# EAGLE design thermocontrol (EAGLE 9.6.2)
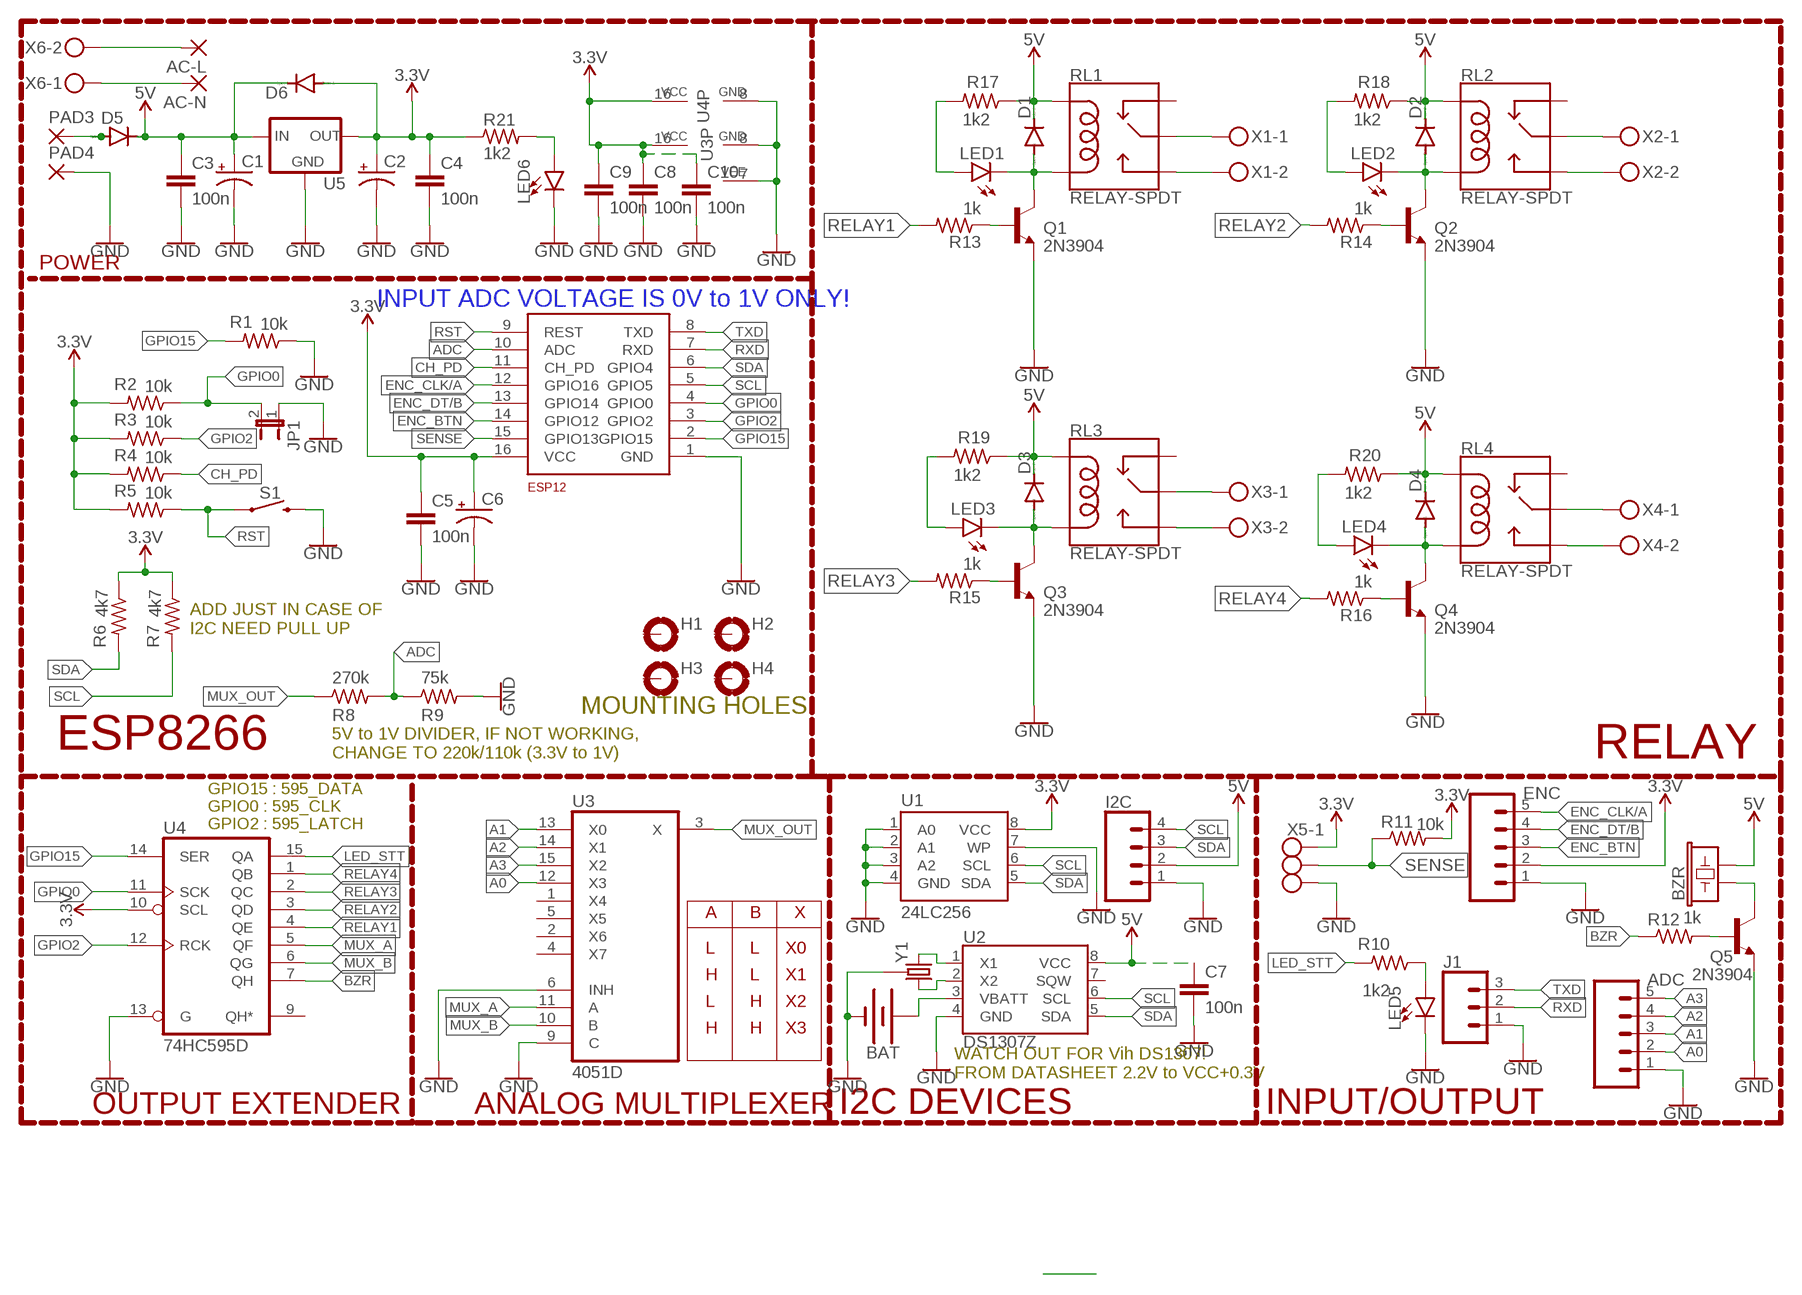
[diagram p0: schematic, sheet 1]

## Parts
AC-L  2,54/1,1  [2,54/1,1]
AC-N  2,54/1,1  [2,54/1,1]
ADC  CONN_05  [1X05]
BAT  BATTERY-20MM_PTH_KIT  [BATTCOM_20MM_PTH_KIT]
BZR  BUZZER-PTH_KIT  [BUZZER-12MM-KIT]
C1  CPOL-USE2.5-6  [E2,5-6]
C2  CPOL-USE2.5-6  [E2,5-6]
C3  100n  C-EUC0805  [C0805]
C4  100n  C-EUC0805  [C0805]
C5  100n  C-EUC0805  [C0805]
C6  CPOL-USD/7343-31R  [D/7343-31R]
C7  100n  C-EUC0805  [C0805]
C8  100n  C-EUC0805  [C0805]
C9  100n  C-EUC0805  [C0805]
C10  100n  C-EUC0805  [C0805]
D1  DIODE-DO-214AC  [DO-214AC]
D2  DIODE-DO-214AC  [DO-214AC]
D3  DIODE-DO-214AC  [DO-214AC]
D4  DIODE-DO-214AC  [DO-214AC]
D5  DIODE-DO-214AC  [DO-214AC]
D6  DIODE-DO-214AC  [DO-214AC]
ENC  CONN_05  [1X05]
ESP12  ESP8266_ESP-12  [ESP8266-ESP12]
H1  MOUNT-PAD-ROUND2.8  [2,8-PAD]
H2  MOUNT-PAD-ROUND2.8  [2,8-PAD]
H3  MOUNT-PAD-ROUND2.8  [2,8-PAD]
H4  MOUNT-PAD-ROUND2.8  [2,8-PAD]
I2C  CONN_04PTH  [1X04]
J1  455-1750-1-ND  CONN_03  [1X03]
JP1  JP1E  [JP1]
LED1  LEDCHIP-LED0805  [CHIP-LED0805]
LED2  LEDCHIP-LED0805  [CHIP-LED0805]
LED3  LEDCHIP-LED0805  [CHIP-LED0805]
LED4  LEDCHIP-LED0805  [CHIP-LED0805]
LED5  LEDCHIP-LED0805  [CHIP-LED0805]
LED6  LEDCHIP-LED0805  [CHIP-LED0805]
PAD3  2,54/1,1  [2,54/1,1]
PAD4  2,54/1,1  [2,54/1,1]
Q1  2N3904  [TO92]
Q2  2N3904  [TO92]
Q3  2N3904  [TO92]
Q4  2N3904  [TO92]
Q5  2N3904  [TO92]
R1  10k  R-US_M0805  [M0805]
R2  10k  R-US_M0805  [M0805]
R3  10k  R-US_M0805  [M0805]
R4  10k  R-US_M0805  [M0805]
R5  10k  R-US_M0805  [M0805]
R6  4k7  R-US_M0805  [M0805]
R7  4k7  R-US_M0805  [M0805]
R8  270k  R-US_M0805  [M0805]
R9  75k  R-US_M0805  [M0805]
R10  1k2  R-US_M0805  [M0805]
R11  10k  R-US_M0805  [M0805]
R12  1k  R-US_M0805  [M0805]
R13  1k  R-US_M0805  [M0805]
R14  1k  R-US_M0805  [M0805]
R15  1k  R-US_M0805  [M0805]
R16  1k  R-US_M0805  [M0805]
R17  1k2  R-US_M0805  [M0805]
R18  1k2  R-US_M0805  [M0805]
R19  1k2  R-US_M0805  [M0805]
R20  1k2  R-US_M0805  [M0805]
R21  1k2  R-US_M0805  [M0805]
RL1  RELAY-SPDT  [RELAY_G5LE]
RL2  RELAY-SPDT  [RELAY_G5LE]
RL3  RELAY-SPDT  [RELAY_G5LE]
RL4  RELAY-SPDT  [RELAY_G5LE]
S1  MOMENTARY-SWITCH-SPST-SMD-6.2MM-TALL  [TACTILE_SWITCH_SMD_6.2MM_TALL]
U1  24LC256  EEPROM-I2C256K  [SO08]
U2  DS1307Z  [SO08-0.15]
U3  4051D  [SO16]
U4  74HC595D  [SO16]
U5  XC63FPP  [SOT89R]
X1  MKDSN1,5/2-5,08  [MKDSN1,5/2-5,08]
X2  MKDSN1,5/2-5,08  [MKDSN1,5/2-5,08]
X3  MKDSN1,5/2-5,08  [MKDSN1,5/2-5,08]
X4  MKDSN1,5/2-5,08  [MKDSN1,5/2-5,08]
X5  MKDSN1,5/3-5,08  [MKDSN1,5/3-5,08]
X6  MKDSN1,5/2-5,08  [MKDSN1,5/2-5,08]
Y1  CRYSTAL-32.768KHZ-CT  [CRYSTAL-PTH-2X6-CYL]

## Nets
3.3V: C2.+ C4.1 C5.1 C6.+ C8.1 C9.1 C10.1 D6.A ENC.2 ESP12.16(VCC) R2.2 R3.2 R4.2 R5.2 R6.1 R7.1 R11.2 R21.1 U1.8(VCC) U3.16(VCC) U4.10(SCL) U4.16(VCC) U5.3(OUT) U5.4(OUT) X5.1
5V: BZR.- C1.+ C3.1 C7.1 D1.C D2.C D3.C D4.C D5.C D6.C I2C.2 R17.1 R18.1 R19.1 R20.1 RL1.2(COIL1) RL2.2(COIL1) RL3.2(COIL1) RL4.2(COIL1) U2.8(VCC) U5.2(IN)
A0: ADC.2 U3.12(X3)
A1: ADC.3 U3.13(X0)
A2: ADC.4 U3.14(X1)
A3: ADC.5 U3.15(X2)
ADC: ESP12.10(ADC) R8.2 R9.1
BZR: R12.1 U4.7(QH)
CH_PD: ESP12.11(CH_PD) R4.1
ENC_BTN: ENC.3 ESP12.14(GPIO12)
ENC_CLK/A: ENC.5 ESP12.12(GPIO16)
ENC_DT/B: ENC.4 ESP12.13(GPIO14)
GND: ADC.1 BAT.2(-) C1.- C2.- C3.2 C4.2 C5.2 C6.- C7.2 C8.2 C9.2 C10.2 ENC.1 ESP12.1(GND) I2C.1 J1.1 JP1.1 LED5.C LED6.C PAD4.1(P) Q1.3(E) Q2.3(E) Q3.3(E) Q4.3(E) Q5.3(E) R1.1 R9.2 S1.B2 U1.1(A0) U1.2(A1) U1.3(A2) U1.4(GND) U2.4(GND) U3.6(INH) U3.7(VEE) U3.8(GND) U3.9(C) U4.8(GND) U4.13(G) U5.1(GND) X5.3 Y1.P$1(GND)
GPIO0: ESP12.4(GPIO0) JP1.2 R2.1 U4.11(SCK)
GPIO2: ESP12.3(GPIO2) R3.1 U4.12(RCK)
GPIO15: ESP12.2(GPIO15) R1.2 U4.14(SER)
LED_STT: R10.2 U4.15(QA)
MUX_A: U3.11(A) U4.5(QF)
MUX_B: U3.10(B) U4.6(QG)
MUX_OUT: R8.1 U3.3(X)
N$1: Q4.2(B) R16.1
N$2: Q2.2(B) R14.1
N$3: Q1.2(B) R13.1
N$4: Q3.2(B) R15.1
N$5: Q5.2(B) R12.2
N$6: LED1.A R17.2
N$7: LED2.A R18.2
N$8: D5.A PAD3.1(P)
N$9: LED3.A R19.2
N$10: AC-N.1(P) X6.1
N$11: AC-L.1(P) X6.2
N$12: LED4.A R20.2
N$13: U1.7(WP) ; supply symbol labelled GND
N$17: D1.A LED1.C Q1.1(C) RL1.5(COIL2)
N$18: LED6.A R21.2
N$19: RL1.3(NO) X1.2
N$20: RL1.1(MAIN) X1.1
N$21: D2.A LED2.C Q2.1(C) RL2.5(COIL2)
N$22: RL2.3(NO) X2.2
N$23: RL2.1(MAIN) X2.1
N$24: D3.A LED3.C Q3.1(C) RL3.5(COIL2)
N$25: RL3.3(NO) X3.2
N$26: RL3.1(MAIN) X3.1
N$27: D4.A LED4.C Q4.1(C) RL4.5(COIL2)
N$28: RL4.3(NO) X4.2
N$29: RL4.1(MAIN) X4.1
N$30: BAT.1(+) U2.3(VBATT)
N$31: BZR.+ Q5.1(C)
N$33: LED5.A R10.1
N$34: U2.2(X2) Y1.2
N$35: U2.1(X1) Y1.1
RELAY1: R13.2 U4.4(QE)
RELAY2: R14.2 U4.3(QD)
RELAY3: R15.2 U4.2(QC)
RELAY4: R16.2 U4.1(QB)
RST: ESP12.9(REST) R5.1 S1.A2
RXD: ESP12.7(RXD) J1.2
SCL: ESP12.5(GPIO5) I2C.4 R7.2 U1.6(SCL) U2.6(SCL)
SDA: ESP12.6(GPIO4) I2C.3 R6.2 U1.5(SDA) U2.5(SDA)
SENSE: ESP12.15(GPIO13) R11.1 X5.2
TXD: ESP12.8(TXD) J1.3
Unconnected: H1.B2,8(MOUNT) H2.B2,8(MOUNT) H3.B2,8(MOUNT) H4.B2,8(MOUNT) RL1.4(NC) RL2.4(NC) RL3.4(NC) RL4.4(NC) U2.7(SQW) U3.1(X4) U3.2(X6) U3.4(X7) U3.5(X5) U4.9(QH*)

## Notes on the sheet
- POWER
- INPUT ADC VOLTAGE IS 0V to 1V ONLY!
- ADD JUST IN CASE OF 
  I2C NEED PULL UP
- MOUNTING HOLES
- ESP8266
- 5V to 1V DIVIDER, IF NOT WORKING, 
  CHANGE TO 220k/110k (3.3V to 1V)
- RELAY
- GPIO15 : 595_DATA
  GPIO0 : 595_CLK
  GPIO2 : 595_LATCH
- A | B | X
- L | L | X0
- H | L | X1
- L | H | X2
- H | H | X3
- WATCH OUT FOR Vih DS1307!
  FROM DATASHEET 2.2V to VCC+0.3V
- OUTPUT EXTENDER | ANALOG MULTIPLEXER | I2C DEVICES | INPUT/OUTPUT

## Library data of the parts
AC-L AC-N PAD3 PAD4 = wirepad:2,54/1,1: THROUGH-HOLE PAD
ADC ENC = SparkFun-Connectors:CONN_05: Multi connection point. Often used as Generic Header-pin footprint for 0.1 inch spaced/style header connections On any of the 0.1 inch spaced packages, you can populate with these: Break Away Headers - Straight <https://www.sparkfun.com/products/116> (PRT-00116) Break Away Male Headers - Right Angle <https://www.sparkfun.com/products/553> (PRT-00553) Female Headers <https://www.sparkfun.com/products/115> (PRT-00115) Break Away Headers - Machine Pin <https://www.sparkfun.com/products/117> (PRT-00117) Break Away Female Headers - Swiss Machine Pin <https://www.sparkfun.com/products/743> (PRT-00743) For SCREWTERMINALS and SPRING TERMINALS visit here: Screw Terimnals on SparkFun.com <https://www.sparkfun.com/search/results?term=Screw+Terminals> (5mm/3.5mm/2.54mm spacing) This device is also useful as a general connection point to wire up your design to another part of your project. Our various solder wires solder well into these plated through hole pads. Hook-Up Wire - Assortment (Stranded, 22 AWG) <https://www.sparkfun.com/products/11375> (PRT-11375) Hook-Up Wire - Assortment (Solid Core, 22 AWG) <https://www.sparkfun.com/products/11367> (PRT-11367) View the entire wire category on our website here <https://www.sparkfun.com/categories/141> Special notes: Molex polarized connector foot print use with SKU : PRT-08231 with associated crimp pins and housings. 1MM SMD Version SKU: PRT-10208
BAT = SparkFun-Batteries:BATTERY: Battery - Single Cell A variety of battery chemistries, sizes, and footprints. Device List: 20MM_PTH - Coin Cell Battery Holder - 20mm (PTH) <https://www.sparkfun.com/products/783> 20MM_PTH_KIT- Coin Cell battery Holder - 20 mm (PTH) <http://www.sparkfun.com/products/783>kit version with special mask 6.8MM_PTH - Coin Cell Battery Holder - 6.8MM(SMD) <https://www.digikey.com/product-detail/en/seiko-instruments/MS621FE-FL11E/728-1057-ND/1889208?WT.srch=1&gclid=CNOQ5a6LzdQCFZS2wAodXCkE0g> 12MM_SMD - Coin Cell Battery Holder - 12mm (SMD) <https://www.sparkfun.com/products/10592> 12MM_PTH - Coin Cell Battery Holder - 12mm (PTH) <https://www.sparkfun.com/products/7948> 20MM_SMD - 20mm Coin Cell Battery Holder (SMD) (2 legs) Used on the Big Time Watch Kit <https://www.sparkfun.com/products/11734> 20MM_SMD_4LEGS - Coin Cell Battery Holder - 20mm (SMD) <https://www.sparkfun.com/products/11892> 20MM_SMD_4LEGS_OVERPASTE - Coin Cell Battery Holder - 20mm (SMD) <https://www.sparkfun.com/products/11892> (Over-paste on the legs) 24.5MM_PTH - Coin Cell Battery Holder - 24.5mm (PTH) <https://www.sparkfun.com/products/8863> 9V - 9V Battery Holder - PC Mount Used on the SparkFun SparkPunk Sound Kit <https://www.sparkfun.com/products/11177> and SparkFun SparkPunk Sequencer Kit <https://www.sparkfun.com/products/12707> 18650 - Battery Holder - 18650 (PTH) <https://www.sparkfun.com/products/13113> AA - Battery Holder - 1xAA (PTH) <https://www.sparkfun.com/products/7949> AAA - Battery Holder - 1xAAA (PTH) <https://www.sparkfun.com/products/12718> AA_KIT - Battery Holder - 1xAA (PTH) <https://www.sparkfun.com/products/7949> Special kit package - pads only have exposed copper on one side of the board. AAA_KIT - Battery Holder - 1xAAA (PTH) <https://www.sparkfun.com/products/12718> Special kit package - pads only have exposed copper on one side of the board.
BZR = SparkFun-Electromechanical:BUZZER: Buzzer Small round buzzers that operate around the audible 2kHz range. You can use these as speakers to create simple music or user interfaces. Variant Overview: PTH - Mini Speaker - PC Mount 12mm 2.048kHz <https://www.sparkfun.com/products/7950> PTH_KIT - Mini Speaker - PC Mount 12mm 2.048kHz <https://www.sparkfun.com/products/7950> KIT simplifies soldering by adding stop mask to one side of the pads. PTH_NO_SILK - Mini Speaker - PC Mount 12mm 2.048kHz <https://www.sparkfun.com/products/7950> No silkscreen indicator of buzzer outline. PTH_KIT_NO_SILK - Mini Speaker - PC Mount 12mm 2.048kHz <https://www.sparkfun.com/products/7950> KIT package w/o silkscreen SMD - Buzzer Audio Magnetic (CCV-084B16) SMD buzzer used on, e.g. the LilyPad Buzzer <https://www.sparkfun.com/products/8463> and RFID USB Reader <https://www.sparkfun.com/products/9963>. SMD_KIT - Buzzer Audio Magnetic (CCV-084B16) SMD Buzzer with elongated pins to make soldering easier. Used on the SparkFun Simon Says - Surface Mount Soldering Kit <https://www.sparkfun.com/products/10935>.; PROD_ID: COMP-08253; SF_SKU: COM-07950
C1 C2 C6 = rcl:CPOL-US: POLARIZED CAPACITOR, American symbol; SPICEPREFIX: C
C3-C5 C7-C10 = rcl:C-EU: CAPACITOR, European symbol; SPICEPREFIX: C
D1-D6 = diode:DIODE-: DIODE
ESP12 = esp12:ESP8266_ESP-12
H1-H4 = holes:MOUNT-PAD-ROUND: MOUNTING PAD, round
I2C = SparkFun-Connectors:CONN_04: Multi connection point. Often used as Generic Header-pin footprint for 0.1 inch spaced/style header connections On any of the 0.1 inch spaced packages, you can populate with these: Break Away Headers - Straight <https://www.sparkfun.com/products/116> (PRT-00116) Break Away Male Headers - Right Angle <https://www.sparkfun.com/products/553> (PRT-00553) Female Headers <https://www.sparkfun.com/products/115> (PRT-00115) Break Away Headers - Machine Pin <https://www.sparkfun.com/products/117> (PRT-00117) Break Away Female Headers - Swiss Machine Pin <https://www.sparkfun.com/products/743> (PRT-00743) For SCREWTERMINALS and SPRING TERMINALS visit here: Screw Terimnals on SparkFun.com <https://www.sparkfun.com/search/results?term=Screw+Terminals> (5mm/3.5mm/2.54mm spacing) This device is also useful as a general connection point to wire up your design to another part of your project. Our various solder wires solder well into these plated through hole pads. Hook-Up Wire - Assortment (Stranded, 22 AWG) <https://www.sparkfun.com/products/11375> (PRT-11375) Hook-Up Wire - Assortment (Solid Core, 22 AWG) <https://www.sparkfun.com/products/11367> (PRT-11367) View the entire wire category on our website here <https://www.sparkfun.com/categories/141> Special notes: Molex polarized connector foot print use with SKU : PRT-08231 with associated crimp pins and housings. 1MM SMD Version SKU: PRT-10208; PROD_ID: CONN-09696
J1 = SparkFun-Connectors:CONN_03: Multi connection point. Often used as Generic Header-pin footprint for 0.1 inch spaced/style header connections On any of the 0.1 inch spaced packages, you can populate with these: Break Away Headers - Straight <https://www.sparkfun.com/products/116> (PRT-00116) Break Away Male Headers - Right Angle <https://www.sparkfun.com/products/553> (PRT-00553) Female Headers <https://www.sparkfun.com/products/115> (PRT-00115) Break Away Headers - Machine Pin <https://www.sparkfun.com/products/117> (PRT-00117) Break Away Female Headers - Swiss Machine Pin <https://www.sparkfun.com/products/743> (PRT-00743) Stackable Header - 3 Pin (Female, 0.1") <https://www.sparkfun.com/products/13875> (PRT-13875) For SCREWTERMINALS and SPRING TERMINALS visit here: Screw Terimnals on SparkFun.com <https://www.sparkfun.com/search/results?term=Screw+Terminals> (5mm/3.5mm/2.54mm spacing) This device is also useful as a general connection point to wire up your design to another part of your project. Our various solder wires solder well into these plated through hole pads. Hook-Up Wire - Assortment (Stranded, 22 AWG) <https://www.sparkfun.com/products/11375> (PRT-11375) Hook-Up Wire - Assortment (Solid Core, 22 AWG) <https://www.sparkfun.com/products/11367> (PRT-11367) View the entire wire category on our website here <https://www.sparkfun.com/categories/141> Special notes: Molex polarized connector foot print use with SKU : PRT-08232 with associated crimp pins and housings.; PROD_ID: XXX-00000
JP1 = jumper:JP1E: JUMPER
LED1-LED6 = led:LED: LED OSRAM: - CHIPLED LG R971, LG N971, LY N971, LG Q971, LY Q971, LO R971, LY R971 LH N974, LH R974 LS Q976, LO Q976, LY Q976 LO Q996 - Hyper CHIPLED LW Q18S LB Q993, LB Q99A, LB R99A - SideLED LS A670, LO A670, LY A670, LG A670, LP A670 LB A673, LV A673, LT A673, LW A673 LH A674 LY A675 LS A676, LA A676, LO A676, LY A676, LW A676 LS A679, LY A679, LG A679 - Hyper Micro SIDELED® LS Y876, LA Y876, LO Y876, LY Y876 LT Y87S - SmartLED LW L88C, LW L88S LB L89C, LB L89S, LG L890 LS L89K, LO L89K, LY L89K LS L896, LA L896, LO L896, LY L896 - TOPLED LS T670, LO T670, LY T670, LG T670, LP T670 LSG T670, LSP T670, LSY T670, LOP T670, LYG T670 LG T671, LOG T671, LSG T671 LB T673, LV T673, LT T673, LW T673 LH T674 LS T676, LA T676, LO T676, LY T676, LB T676, LH T676, LSB T676, LW T676 LB T67C, LV T67C, LT T67C, LS T67K, LO T67K, LY T67K, LW E67C LS E67B, LA E67B, LO E67B, LY E67B, LB E67C, LV E67C, LT E67C LW T67C LS T679, LY T679, LG T679 LS T770, LO T770, LY T770, LG T770, LP T770 LB T773, LV T773, LT T773, LW T773 LH T774 LS E675, LA E675, LY E675, LS T675 LS T776, LA T776, LO T776, LY T776, LB T776 LHGB T686 LT T68C, LB T68C - Hyper Mini TOPLED® LB M676 - Mini TOPLED Santana® LG M470 LS M47K, LO M47K, LY M47K Source: http://www.osram.convergy.de LUXEON: - LUMILED® LXK2-PW12-R00, LXK2-PW12-S00, LXK2-PW14-U00, LXK2-PW14-V00 LXK2-PM12-R00, LXK2-PM12-S00, LXK2-PM14-U00 LXK2-PE12-Q00, LXK2-PE12-R00, LXK2-PE12-S00, LXK2-PE14-T00, LXK2-PE14-U00 LXK2-PB12-K00, LXK2-PB12-L00, LXK2-PB12-M00, LXK2-PB14-N00, LXK2-PB14-P00, LXK2-PB14-Q00 LXK2-PR12-L00, LXK2-PR12-M00, LXK2-PR14-Q00, LXK2-PR14-R00 LXK2-PD12-Q00, LXK2-PD12-R00, LXK2-PD12-S00 LXK2-PH12-R00, LXK2-PH12-S00 LXK2-PL12-P00, LXK2-PL12-Q00, LXK2-PL12-R00 Source: www.luxeon.com KINGBRIGHT: KA-3528ASYC Source: www.kingbright.com
Q1-Q5 = transistor-npn:2N3904: NPN Transistor
R1-R21 = rcl:R-US_: RESISTOR, American symbol; SPICEPREFIX: R
RL1-RL4 = SparkFun-Electromechanical:RELAY-SPDT: SPDT Electromechanical Relay Single-pole, double-throw sealed relays. When current is applied to the coil, it throws a simple changeover switch, terminating the connection from the NC contact to ground and closing the NO contact. Use them to switch high voltage/high current devices. SparkFun Products JQX-15F: Relay SPDT Sealed - 20A <https://www.sparkfun.com/products/10924> (COM-10924) JZC-11F: Relay SPDT Sealed <https://www.sparkfun.com/products/100> (COM-00100); PROD_ID: COMP-14214
S1 = SparkFun-Switches:MOMENTARY-SWITCH-SPST: Momentary Switch (Pushbutton) - SPST Normally-open (NO) SPST momentary switches (buttons, pushbuttons). Variants PTH-12MM - 12mm square, through-hole Momentary Pushbutton Switch - 12mm Square <https://www.sparkfun.com/products/9190> (COM-09190) PTH-6.0MM, PTH-6.0MM-KIT - 6.0mm square, through-hole Mini Pushbutton Switch <https://www.sparkfun.com/products/97> (COM-00097) KIT package intended for soldering kit's - only one side of pads' copper is exposed. PTH-RIGHT-ANGLE-KIT - Right-angle, through-hole Right Angle Tactile Button <https://www.sparkfun.com/products/10791> - Used on SparkFun BigTime Watch Kit <https://www.sparkfun.com/products/11734> SMD-12MM - 12mm square, surface-mount Tactile Button - SMD (12mm) <https://www.sparkfun.com/products/12993> (COM-12993) Used on SparkFun PicoBoard <https://www.sparkfun.com/products/11888> SMD-4.5MM - 4.5mm Square Trackball Switch Used on SparkFun Blackberry Trackballer Breakout <https://www.sparkfun.com/products/13169> SMD-4.6MMX2.8MM - 4.60mm x 2.80mm, surface mount Used on SparkFun SAMD21 Mini Breakout <https://www.sparkfun.com/products/13664> SMD-5.2MM, SMD-5.2-REDUNDANT - 5.2mm square, surface-mount Mini Pushbutton Switch - SMD <https://www.sparkfun.com/products/8720> (COM-08720) Used on Arduino Pro Mini <https://www.sparkfun.com/products/11114> REDUNDANT package connects both switch circuits together SMD-6.0X3.5MM - 6.0 x 3.5mm, surface mount Momentary Reset Switch SMD <https://www.sparkfun.com/products/8229> (COM-08229) SMD-6.2MM-TALL - 6.2mm square, surface mount Tactile Button - SMD (6mm) <https://www.sparkfun.com/products/12992> Used on SparkFun Digital Sandbox <https://www.sparkfun.com/products/12651> SMD-RIGHT-ANGLE - Right-angle, surface mount Used on SparkFun Block for Intel® Edison - Arduino <https://www.sparkfun.com/products/13036>; PROD_ID: SWCH-11966; SF_SKU: COM-12992
U1 = SparkFun-IC-Memory:EEPROM-I2C: I2C EEPROMs, 24LC256 and others 24LC256 Series 256 kb I2C 2 Wire (32 k x 8 Bit) 2.5 V Serial EEPROM SMD - SOIC-8 Datasheet SparkFun Products SparkFun UDB5 - PIC UAV Development Board <https://www.sparkfun.com/products/11703> (GPS-11703); PROD_ID: IC-09714
U2 = SparkFun-Clocks:DS1307: Maxim DS1307 - I2C Real-time clock (RTC) The DS1307 serial real-time clock (RTC) is a low-power, full binary-coded decimal (BCD) clock/calendar plus 56 bytes of NV SRAM. Address and data are transferred serially through an I2C, bidirectional bus. The clock/calendar provides seconds, minutes, hours, day, date, month, and year information. SparkFun Products: Real Time Clock Module <https://www.sparkfun.com/products/12708> (BOB-12708) Datasheet <https://cdn.sparkfun.com/datasheets/BreakoutBoards/DS1307.pdf>; PROD_ID: IC-08138
U3 = 40xx:4051: 8-channel ANALOG MULTIPLEXER
U4 = 74xx-eu:74*595: 8-bit SHIFT REGISTER, output latch
U5 = v-reg:XC63FP: Positiv Voltage Regulators www.torex.co.jp/english/product/pro02/pdf/0201_xc62fp.pdf
X1-X4 X6 = con-phoenix-508:MKDSN1,5/2-5,08: MKDSN 1,5/ 2-5,08 Printklemme Nennstrom: 13,5 A Nennspannung: 250 V Rastermaß: 5,08 mm Polzahl: 2 Anschlussart: Schraubanschluss Montage: Löten Anschlussrichtung Leiter/Platine: 0 ° Artikelnummer: 1729128 Source: http://eshop.phoenixcontact.com .. 1729128.pdf
X5 = con-phoenix-508:MKDSN1,5/3-5,08: MKDSN 1,5/ 3-5,08 Printklemme Nennstrom: 13,5 A Nennspannung: 250 V Rastermaß: 5,08 mm Polzahl: 3 Anschlussart: Schraubanschluss Montage: Löten Anschlussrichtung Leiter/Platine: 0 ° Artikelnummer: 1729131 Source: http://eshop.phoenixcontact.com .. 1729131.pdf
Y1 = SparkFun-Clocks:CRYSTAL-32.768KHZ-CT

## Board
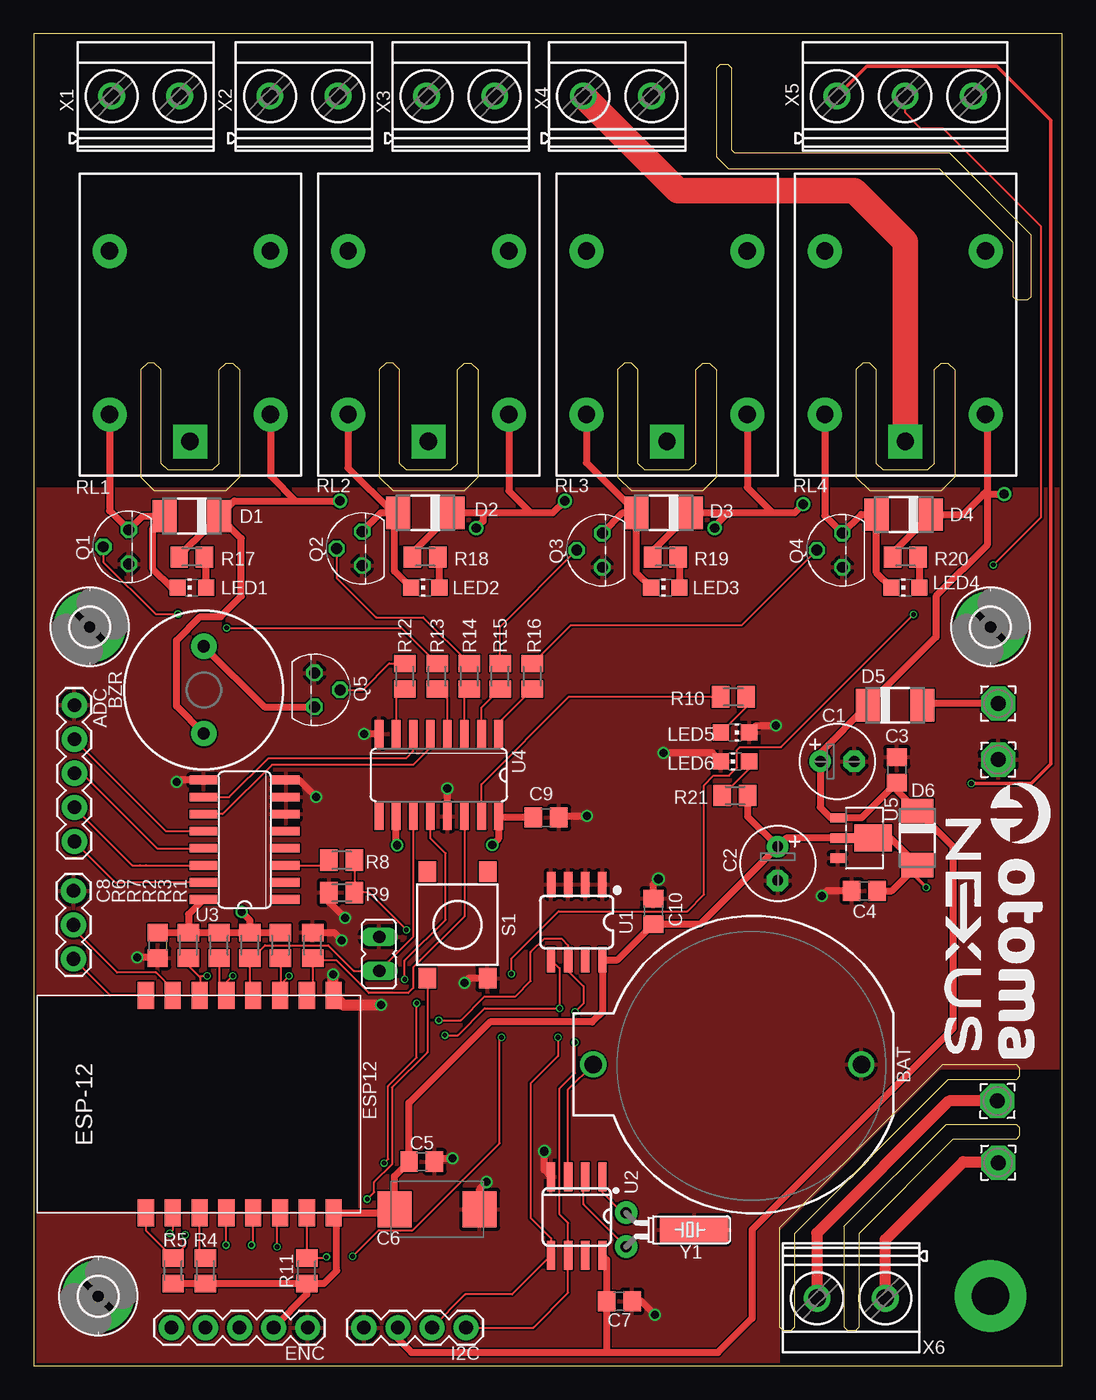
[diagram p1: board, top side]
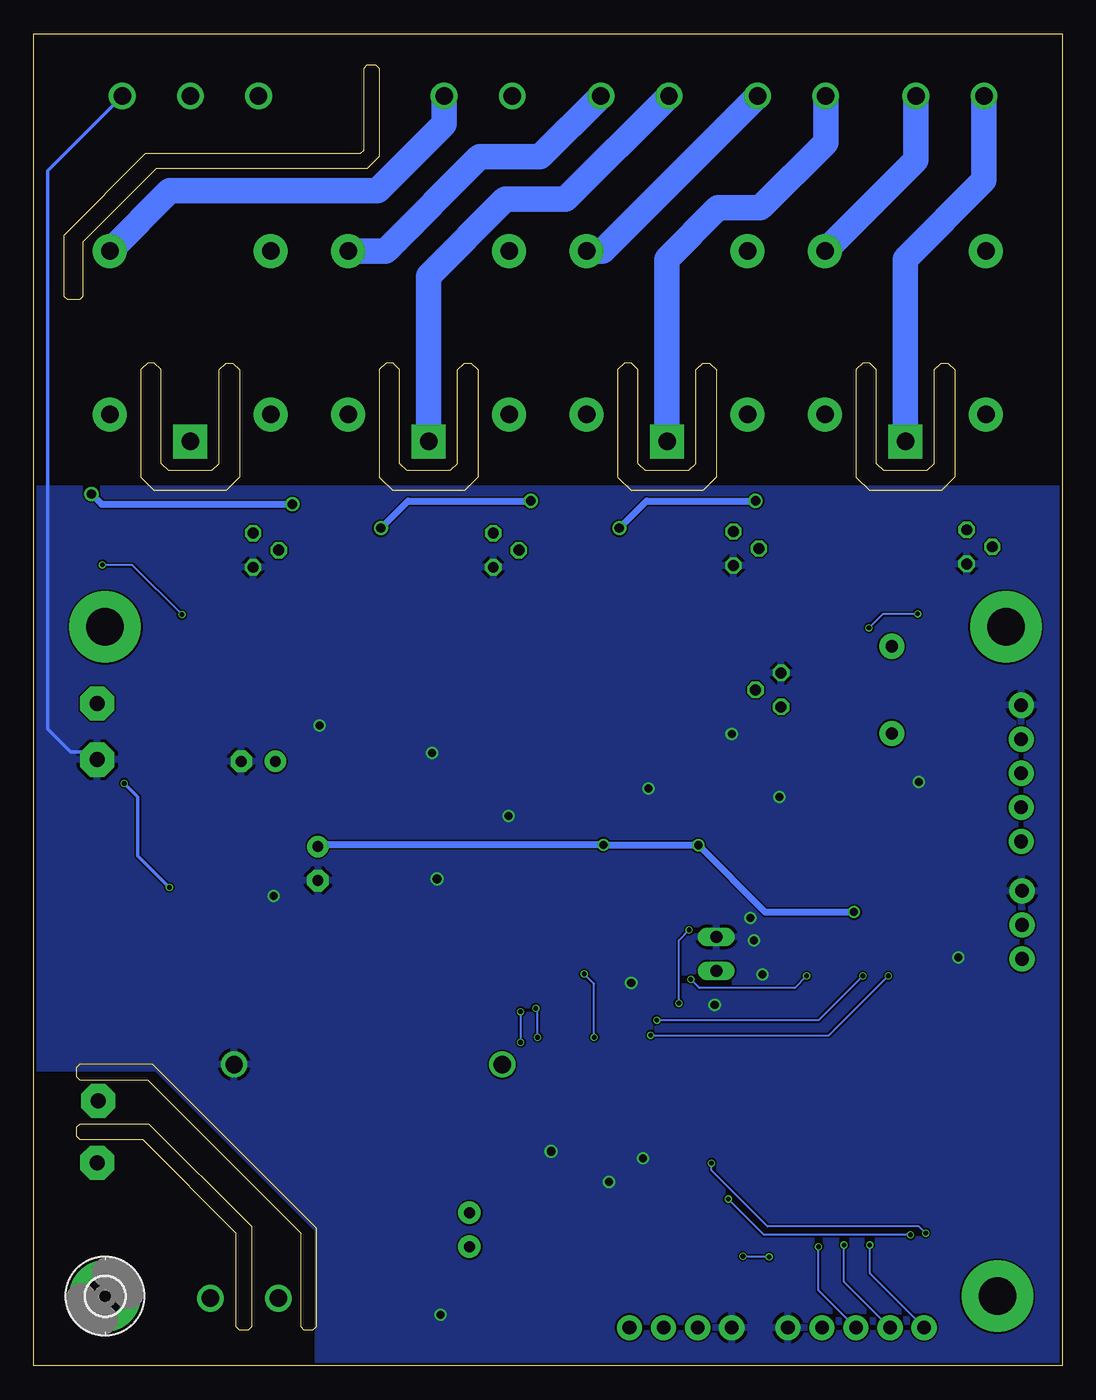
[diagram p2: board, bottom side, seen from below]

Size 76.71 x 99.36 mm. Coordinates in mm from the lower left corner, seen from the top.
Outline: 0,0 76.71,0 76.71,99.36 0,99.36 0,0
Copper layers (1*16): Top 0.035559375mm / dielectric 1.6mm / Bottom 0.035559375mm
Design rules "jlcpcb2layer *": minimum track width 5mil, minimum drill 12mil, track to track 5mil, track to pad 5mil, pad to pad 5mil, via to via 5mil, smd to smd 5mil, copper to edge 8mil, drill to drill 6mil, minimum pad ring 5mil, minimum via ring 3mil, stop-mask expansion 2.5mil, vias tented up to drill 33mil, thermal gap 10mil
Milling: 104 lines

### Footprints (pad centres in the part's own frame; a part is rotated, then mirrored left to right if it is on the bottom)
2,54/1,1 = drill 1.118 pad 2.54 octagon: 1 0,0
1X05 = drill 1.016 pad 1.88: 1 0,0; 2 2.54,0; 3 5.08,0; 4 7.62,0; 5 10.16,0
BATTCOM_20MM_PTH_KIT = drill 1.3: 1 11.85,0; 2 -8.15,0
BUZZER-12MM-KIT = drill 0.9 pad 1.88: + 3.25,0; - -3.25,0
E2,5-6 = drill 0.813 pad 1.6: + -1.27,0 | drill 0.813 pad 1.6 octagon: - 1.27,0
C0805 = smd 1.3 x 1.5: 1 -0.95,0; 2 0.95,0
D/7343-31R = smd 2.55 x 2.7: + 3.175,0; - -3.175,0
DO-214AC = smd 1.8 x 2.4: A 2.025,0; C -2.025,0
ESP8266-ESP12 = smd 2 x 1.2: 1 16.2,2; 2 16.2,4; 3 16.2,6; 4 16.2,8; 5 16.2,10; 6 16.2,12; 7 16.2,14; 8 16.2,16; 9 0,16; 10 0,14; 11 0,12; 12 0,10; 13 0,8; 14 0,6; 15 0,4; 16 0,2
2,8-PAD = drill 2.8 pad 5.334: B2,8 0,0
1X04 = drill 1.016 pad 1.88: 1 0,0; 2 2.54,0; 3 5.08,0; 4 7.62,0
1X03 = drill 1.016 pad 1.88: 1 0,0; 2 2.54,0; 3 5.08,0
JP1 = drill 0.914 long: 1 0,-1.27; 2 0,1.27
CHIP-LED0805 = smd 1.2 x 1.2: A 0,-1.05; C 0,1.05
TO92 = drill 0.813 octagon: 1 1.27,0; 2 0,1.905; 3 -1.27,0
M0805 = smd 1.3 x 1.6: 1 -0.95,0; 2 0.95,0
RELAY_G5LE = drill 1.3 pad 2.54 square: 1 8.52,-0.005 | drill 1.3 pad 2.54: 2 6.52,5.995; 3 -5.68,5.995; 4 -5.68,-6.005; 5 6.52,-6.005
TACTILE_SWITCH_SMD_6.2MM_TALL = smd 1.55 x 1.3: A1 -3.975,-2.25; A2 3.975,-2.25; B1 -3.975,2.25; B2 3.975,2.25
SO08 = smd 0.61 x 1.905: 1 -1.905,-2.8; 2 -0.635,-2.8; 3 0.635,-2.8; 4 1.905,-2.8 | smd 0.6 x 1.905: 5 1.905,2.8; 6 0.635,2.8; 7 -0.635,2.8; 8 -1.905,2.8
SO08-0.15 = smd 0.6 x 2.159: 1 -1.905,-2.927; 2 -0.635,-2.927; 3 0.635,-2.927; 4 1.905,-2.927; 5 1.905,2.927; 6 0.635,2.927; 7 -0.635,2.927; 8 -1.905,2.927
SO16 = smd 0.66 x 2.032: 1 -4.445,-3.073; 2 -3.175,-3.073; 3 -1.905,-3.073; 4 -0.635,-3.073; 5 0.635,-3.073; 6 1.905,-3.073; 7 3.175,-3.073; 8 4.445,-3.073; 9 4.445,3.073; 10 3.175,3.073; 11 1.905,3.073; 12 0.635,3.073; 13 -0.635,3.073; 14 -1.905,3.073; 15 -3.175,3.073; 16 -4.445,3.073
SOT89R = smd 0.7 x 1.1: 1 1.5,-1.75; 2 -1.5,-1.75 | smd 0.7 x 1.8: 3 0,-1.4 | smd 2 x 2.8: 4 0,0.9
MKDSN1,5/2-5,08 = drill 1.3 pad 2: 1 -2.561,0.025; 2 2.519,0.025
MKDSN1,5/3-5,08 = drill 1.3 pad 2: 1 -7.641,0.025; 2 -2.561,0.025; 3 2.519,0.025
CRYSTAL-PTH-2X6-CYL = drill 0.813 pad 1.676: 1 -1.27,0; 2 1.27,0 | smd 1.93 x 5.08: P$1 0,5.08

### Placement (x,y rotation side)
AC-L  71.88,19.76 180 top
AC-N  71.95,15.16 180 top
ADC  3.05,49.28 270 top
BAT  53.59,22.48 180 top
BZR  12.7,50.42 90 top
C1  59.94,45.09 0 top
C2  55.5,37.47 270 top
C3  64.39,44.45 90 top
C4  61.98,35.43 180 top
C5  28.96,15.24 0 top
C6  30.1,11.68 180 top
C7  43.69,4.83 0 top
C8  9.27,31.37 270 top
C9  38.23,40.89 0 top
C10  46.23,33.91 90 top
D1  11.81,63.37 180 top
D2  29.21,63.63 180 top
D3  46.99,63.63 180 top
D4  64.9,63.5 180 top
D5  64.26,49.28 0 top
D6  65.91,39.37 270 top
ENC  20.45,2.86 180 top
ESP12  24.38,11.43 90 top
H1  4.19,55.12 0 top
H2  71.37,55.12 0 top
H3  4.83,5.21 0 top
H4  71.37,5.21 0 bottom
I2C  24.64,2.86 0 top
J1  2.98,35.43 270 top
JP1  25.78,30.73 180 top
LED1  11.81,58.04 90 top
LED2  29.21,58.04 90 top
LED3  47.12,58.04 90 top
LED4  65.02,58.04 90 top
LED5  52.32,47.24 270 top
LED6  52.32,45.09 90 top
PAD3  71.95,49.4 0 top
PAD4  71.95,45.21 0 top
Q1  7.11,61.09 90 top
Q2  24.51,60.96 90 top
Q3  42.42,60.83 90 top
Q4  60.33,60.83 90 top
Q5  20.95,50.42 270 top
R1  20.83,31.37 270 top
R2  16.13,31.37 90 top
R3  18.41,31.37 90 top
R4  12.83,7.11 270 top
R5  10.41,7.11 270 top
R6  11.56,31.37 270 top
R7  13.84,31.37 270 top
R8  22.99,37.72 0 top
R9  22.99,35.31 180 top
R10  52.2,49.91 180 top
R11  20.38,7.11 270 top
R12  27.69,51.44 90 top
R13  30.1,51.44 270 top
R14  32.51,51.44 270 top
R15  34.8,51.44 270 top
R16  37.21,51.44 270 top
R17  11.81,60.33 0 top
R18  29.21,60.33 0 top
R19  47.12,60.33 0 top
R20  65.02,60.33 0 top
R21  52.32,42.55 180 top
RL1  11.68,77.47 270 top
RL2  29.46,77.47 270 top
RL3  47.24,77.47 270 top
RL4  65.02,77.47 270 top
S1  31.62,32.89 270 top
U1  40.51,33.1 180 top
U2  40.51,11.18 180 top
U3  15.75,39.24 90 top
U4  30.23,44.07 180 top
U5  61.72,39.37 270 top
X1  8.38,94.68 0 top
X2  20.19,94.68 0 top
X3  31.88,94.68 0 top
X4  43.56,94.68 0 top
X5  67.56,94.68 0 top
X6  60.96,5.08 180 top
Y1  44.2,10.16 270 top

### Tracks (layer width: path | path; a pad name or v marks a point on that pad's centre or on a via)
3.3V  (via drill 0.35, 0.6)
  Top 0.254: X5.1 62.15,96.93 71.83,96.93 75.87,92.89 75.87,44.88 74.43,43.44 v69.94,43.44 | v66.57,35.69 65.69,36.57 65.69,37.57
  Top 0.508: C4.1 64,35.43 D6.A 65.69,37.57 63.89,39.37 U5.4 U5.3 56.13,39.37 C2.+ | C2.+ 53.27,40.96 R21.1 | U3.16 11.56,33.68 R6.1 | C8.1 R6.1 | R6.1 R7.1 R2.2 | R2.2 R3.2 | R5.2 R4.2 R11.2 | R11.2 21.66,6.16 22.61,7.11 22.61,11.21 ESP12.16 26.67,11.43 C6.+ 26.92,14.16 C5.1 28.01,19.62 34.04,25.65 41.66,25.65 42.42,26.42 U1.8 43.56,30.3 C10.1 49.72,32.96 C2.+ | C9.1 34.77,40.89 U4.16 34.67,39.32 v34.21,38.86 | v27.13,38.84 27.05,38.91 U4.10 | v15.52,33.86 16.13,33.25 R2.2 | R11.2 20.38,5.33 ENC.2
  Bottom 0.254: v69.94,43.44 68.94,42.44 68.94,38.05 v66.57,35.69
  Bottom 0.508: v15.52,33.86 22.15,33.86 v27.13,38.84 27.15,38.86 v34.21,38.86 55.37,38.86 C2.+
5V  (via drill 0.7)
  Top 0.508: 71.12,65.28 70.87,65.02 | 70.87,65.02 69.34,63.5 D4.C 64.07,60.65 R20.1 | 71.12,65.28 71.12,70.85 RL4.2 | 71.12,65.28 71.12,61.21 67.31,57.4 67.31,54.35 D5.C 58.67,45.71 C1.+ 58.67,41.66 59.46,40.87 U5.2 61.76,40.87 C3.1 64.39,42.92 D6.C 68.58,38.73 68.58,25.15 53.59,10.16 53.59,3.56 51.05,1.02 42.8,1.02 | 70.87,65.02 v72.39,65.02 | 51.82,63.63 D3.C 46.17,60.78 R19.1 | 51.82,63.63 55.12,63.63 | 55.12,63.63 56.77,63.63 v57.4,64.26 | RL3.2 53.24,65.51 55.12,63.63 | 51.82,63.63 50.8,62.61 v50.8,62.48 | 33.53,63.63 D2.C 28.26,60.65 R18.1 | 33.53,63.63 37.08,63.63 | 37.08,63.63 38.73,63.63 v39.62,64.52 | RL2.2 35.46,65.25 37.08,63.63 | 33.53,63.63 33.53,62.99 v33.02,62.48 | D1.C 14.98,64.52 19.56,64.52 | 19.56,64.52 v22.86,64.52 | RL1.2 17.68,66.39 19.56,64.52 | I2C.2 27.18,2.03 28.19,1.02 42.8,1.02 | D1.C 11.97,61.51 11.95,61.51 10.86,60.41 R17.1 | BZR.- 10.67,49.2 10.67,54.1 12.45,55.88 13.97,55.88 15.49,57.4 15.49,61.72 D1.C | 42.8,1.02 42.74,1.08 C7.1 42.74,7.93 U2.8
  Bottom 0.508: v72.39,65.02 71.63,64.26 v57.4,64.26 | v50.8,62.48 48.77,64.52 v39.62,64.52 | v33.02,62.48 30.99,64.52 v22.86,64.52
A0
  Top 0.152: ADC.2 9.91,39.88 U3.12
A1
  Top 0.152: U3.13 9.21,38.61 3.62,44.2 ADC.3
A2
  Top 0.152: U3.14 8.38,37.34 7.94,37.34 7.37,37.34 ADC.4
A3
  Top 0.152: U3.15 6.86,36.07 6.67,36.07 6.1,36.07 ADC.5
ADC  (via drill 0.35)
  Top 0.152: R8.2 R9.1 25.02,35.31 v27.81,32.51 | v28.57,27.05 28.57,23 26.45,20.88 26.45,15.43 v26.15,15.12 | ESP12.10 10.38,10.13 v10.16,9.91
  Bottom 0.152: v28.57,27.05 28.57,31.75 v27.81,32.51 | v10.16,9.91 10.67,10.41 21.97,10.41 26.15,14.59 v26.15,15.12
BZR
  Top 0.152: R12.1 27.05,49.85 U4.7
CH_PD
  Top 0.152: R4.1 12.38,8.51 ESP12.11
ENC_BTN  (via drill 0.35)
  Top 0.152: v18.16,8.89 18.16,11.21 ESP12.14
  Bottom 0.152: ENC.3 18.16,5.65 v18.16,8.89
ENC_CLK/A  (via drill 0.35)
  Top 0.152: v14.35,9.02 14.35,11.4 ESP12.12
  Bottom 0.152: ENC.5 14.35,6.92 v14.35,9.02
ENC_DT/B  (via drill 0.35)
  Top 0.152: v16.26,9.02 16.38,9.14 ESP12.13
  Bottom 0.152: ENC.4 16.26,6.29 v16.26,9.02
GND  (via drill 0.6, 0.65)
  Top 0.508: C6.- 33.27,13.21 v33.78,13.72 | C5.2 30.16,15.49 v31.24,15.49 | C10.2 46.23,35.94 v46.61,36.32 | S1.B2 32.47,28.92 v32.13,28.57 | R1.1 22.42,32.32 v22.99,31.75 | R9.2 22.04,34.6 v23.24,33.4 | C8.2 9.21,30.48 v7.75,30.48 | C9.2 39.3,41.02 v41.28,41.02 | U4.13 v30.86,43.05 | U4.8 24.66,47.14 v24.64,47.12 | U3.9 10.79,43.69 v10.67,43.56 | U3.8 19.81,43.69 v21.08,42.42 | C4.2 59.18,35.43 v58.8,35.05 | LED6.C 50.64,45.72 v46.99,45.72 | LED5.C 53.88,47.75 v55.37,47.75 | C7.2 45.34,4.83 v46.36,3.81 | U2.4 38.1,14.61 v38.1,16
  Top 0.813: v22.35,29.21 22.35,27.66 ESP12.1 23.09,26.92 v25.91,26.92
  Bottom 0.254: X5.3 75.67,89.12 75.67,47.5 73.94,45.77 71.81,45.77 71.81,45.35 PAD4.1
  pour Bottom: 0.25,65.41 76.45,65.41 76.45,22.86 76.45,22.23 68.2,22.23 67.56,22.23 55.5,10.16 55.5,0 0.25,0
  pour Top: 0.25,65.41 76.45,65.41 76.45,22.23 67.56,22.23 55.5,10.16 55.5,0 0.25,0 0.25,11.43 24.38,11.43 24.38,27.69 0.25,27.69
GPIO0
  Top 0.152: R2.1 16.13,30.23 | 16.13,30.23 16.13,27.89 ESP12.4 | 16.13,30.23 17.27,31.37 21.97,31.37 23.88,29.46 JP1.2 28.32,32 U4.11
GPIO2  (via drill 0.35)
  Top 0.152: R3.1 18.41,27.66 ESP12.3 18.38,28.42 v19.05,29.08 | v27.69,28.83 27.69,30.23 30.73,33.27 30.73,38.23 29.59,39.37 U4.12
  Bottom 0.152: v19.05,29.08 19.94,28.19 27.05,28.19 v27.69,28.83
GPIO15
  Top 0.152: R1.2 20.83,30.23 | 20.83,30.23 20.83,28.07 ESP12.2 | U4.14 32.13,33.53 28.32,29.72 28.32,28.19 27.94,27.81 25.02,27.81 22.61,30.23 20.83,30.23
LED_STT
  Top 0.152: U4.15 33.4,43.38 39.93,49.91 R10.2
MUX_A
  Top 0.152: U4.5 29.59,46.1 28.32,44.83 17.78,44.83 14.1,41.15 U3.11
MUX_B
  Top 0.152: U3.10 14.61,42.42 17.53,45.34 27.81,45.34 28.32,45.85 U4.6
MUX_OUT
  Top 0.152: U3.3 21.66,37.34 R8.1
N$1
  Top 0.152: R16.1 40.07,55.24 52.83,55.24 Q4.2
N$2
  Top 0.152: Q2.2 22.61,58.78 25.55,55.83 29.07,55.83 R14.1
N$3  (via drill 0.35)
  Top 0.152: Q1.2 5.21,59.97 9.09,56.08 v10.77,56.08 | v14.4,55.04 27.44,55.04 R13.1
  Bottom 0.152: v10.77,56.08 13.36,56.08 v14.4,55.04
N$4
  Top 0.152: R15.1 34.8,55.12 Q3.2
N$5
  Top 0.152: Q5.2 24.56,50.42 26.53,52.38 R12.2
N$6
  Top 0.508: LED1.A 12.86,60.23 R17.2
N$7
  Top 0.508: R18.2 30.26,60.23 LED2.A
N$8
  Top 0.508: PAD3.1 66.41,49.4 D5.A
N$9
  Top 0.508: R19.2 48.17,60.23 LED3.A
N$10
  Top 0.813: X6.1 63.52,9.42 69.34,15.24 71.87,15.24 AC-N.1
N$11
  Top 0.813: AC-L.1 68.28,19.76 58.42,9.91 58.42,5.08 X6.2
N$12
  Top 0.508: R20.2 66.07,60.23 LED4.A
N$17
  Top 0.508: LED1.C 10.29,58.04 8.89,59.44 8.89,62.48 D1.A 8.13,63.37 Q1.1 5.68,63.79 RL1.5
N$18
  Top 0.152: LED6.A 53.37,44.55 R21.2
N$19
  Bottom 1.905: X1.2 10.9,89.93 RL1.3
N$20
  Bottom 1.905: X1.1 5.82,88.41 11.68,82.55 RL1.1
N$21
  Top 0.508: RL2.5 23.46,66.97 26.8,63.63 | 26.8,63.63 26.92,63.63 | Q2.1 25.91,63.63 26.8,63.63 | 26.92,63.63 D2.A | LED2.C 26.92,59.27 26.92,63.63
N$22
  Bottom 1.905: X2.2 34.27,83.15 RL2.3
N$23
  Bottom 1.905: X2.1 17.63,91.21 22.48,86.36 25.65,86.36 29.46,82.56 RL2.1
N$24
  Top 0.508: RL3.5 41.24,67.35 D3.A | Q3.1 43.94,63.63 D3.A | LED3.C 44.97,59.14 D3.A
N$25
  Bottom 1.905: X3.2 38.93,90.17 43.43,90.17 50.45,83.15 RL3.3
N$26
  Bottom 1.905: X3.1 37.02,87 41.53,87 47.24,81.28 RL3.1
N$27
  Top 0.508: RL4.5 59.02,63.41 Q4.1 61.72,63.5 D4.A 62.87,59.14 LED4.C
N$28
  Bottom 1.905: X4.2 46.08,92.6 51.05,87.63 66.54,87.63 RL4.3
N$29
  Top 1.905: X4.1 48.07,87.63 61.21,87.63 65.02,83.83 RL4.1
N$30
  Top 0.152: U2.3 39.88,20.61 BAT.1
N$31
  Top 0.508: BZR.+ 17.22,49.15 Q5.1
N$33
  Top 0.152: R10.1 53.15,49.12 LED5.A
N$34
  Top 0.152: Y1.2 41.02,12.06 41.02,13.98 U2.2
N$35
  Top 0.152: Y1.1 43.94,11.43 42.42,12.95 U2.1
RELAY1
  Top 0.152: U4.4 30.86,49.72 R13.2
RELAY2
  Top 0.152: U4.3 32.13,50.1 R14.2
RELAY3
  Top 0.152: U4.2 33.4,49.09 R15.2
RELAY4
  Top 0.152: U4.1 34.67,47.95 R16.2
RST  (via drill 0.35)
  Top 0.152: ESP12.9 8.38,10.09 R5.1 11.3,8.95 v11.3,9.78 | v24.89,12.45 25.4,12.95 25.4,13.72 26.73,15.05 26.73,20.77 29.37,23.4 S1.A2
  Bottom 0.152: v11.3,9.78 22.22,9.78 v24.89,12.45
RXD
  Top 0.152: ESP12.7 10.38,28.1 9.14,29.34 6.22,29.34 2.98,32.58 J1.2
SCL  (via drill 0.35)
  Top 0.152: R7.2 13.84,28.17 ESP12.5 14.38,28.61 v14.86,29.08 | v30.23,25.78 31.88,25.78 33.66,27.56 35.94,27.56 37.08,28.7 37.08,30.86 38.1,31.88 39.37,31.88 39.88,31.37 U1.6 39.88,29.46 41.02,28.32 41.02,27.05 v40.39,26.42 | I2C.4 37.27,2.86 39.88,5.46 U2.6 39.88,10.67 39.24,11.3 39.24,20.7 40.39,21.84 v40.39,24.13
  Bottom 0.152: v14.86,29.08 18.16,25.78 v30.23,25.78 | v40.39,26.42 v40.39,24.13
SDA  (via drill 0.35)
  Top 0.152: R6.2 11.56,29.84 12.32,29.08 | 12.32,29.08 12.45,28.96 12.45,27.69 ESP12.6 | 12.32,29.08 v12.95,29.08 | v30.68,24.66 31.65,24.66 33.66,26.67 v39.24,26.67 39.24,29.66 U1.5 | I2C.3 32.19,5.33 35.69,5.33 U2.5 38.61,9.53 37.08,11.05 37.08,21.08 39.12,23.11 v39.12,24.51
  Bottom 0.152: v39.12,24.51 39.12,26.54 v39.24,26.67 | v12.95,29.08 17.4,24.64 30.66,24.64 v30.68,24.66
SENSE  (via drill 0.35)
  Top 0.152: ESP12.15 R11.1 | R11.1 | R11.1 21.78,8.06 v21.84,8.13 | v23.8,8.18 25.75,10.13 28.28,10.13 34.77,16.62 34.77,24.51 v34.9,24.51 | v35.64,29.23 35.64,30.38 39.17,33.91 48.77,33.91 50.01,35.15 50.01,43.31 50.72,44.02 51.87,44.02 52.48,44.63 52.48,45.95 52.68,46.15 55.75,46.15 v65.63,56.03 | v71.58,59.74 75.16,63.32 75.16,84.96 67.84,92.28 66.19,92.28 65,93.47 X5.2
  Bottom 0.152: v21.84,8.13 23.75,8.13 v23.8,8.18 | v34.9,24.51 34.9,28.5 v35.64,29.23 | v65.63,56.03 69.34,59.74 v71.58,59.74
TXD
  Top 0.152: ESP12.8 5.71,27.63 J1.3